# EAGLE design sensor (EAGLE 5.06)
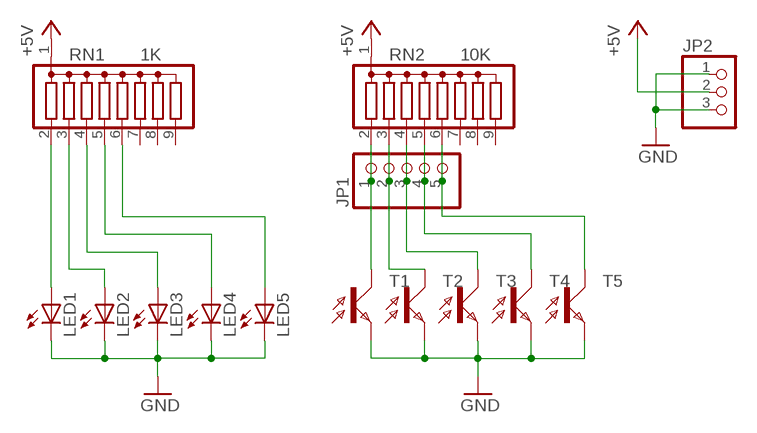
[diagram p0: schematic, sheet 1]

## Parts
JP1  PINHD-1X5  [1X05]
JP2  PINHD-1X3180  [1X03]
LED1  LED5MM  [LED5MM]
LED2  LED5MM  [LED5MM]
LED3  LED5MM  [LED5MM]
LED4  LED5MM  [LED5MM]
LED5  LED5MM  [LED5MM]
RN1  1K  G08R  [SIL9]
RN2  10K  G08R  [SIL9]
T1  BPX81  [LED5MM]
T2  BPX81  [LED5MM]
T3  BPX81  [LED5MM]
T4  BPX81  [LED5MM]
T5  BPX81  [LED5MM]

## Nets
+5V: JP2.2 RN1.1 RN2.1
GND: JP2.1 JP2.3 LED1.K(C) LED2.K(C) LED3.K(C) LED4.K(C) LED5.K(C) T1.A(E) T2.A(E) T3.A(E) T4.A(E) T5.A(E)
N$1: LED1.A RN1.2
N$2: LED2.A RN1.3
N$3: LED3.A RN1.4
N$4: LED4.A RN1.5
N$5: LED5.A RN1.6
N$6: JP1.1 RN2.2 T1.K(C)
N$7: JP1.2 RN2.3 T2.K(C)
N$8: JP1.3 RN2.4 T3.K(C)
N$9: JP1.4 RN2.5 T4.K(C)
N$10: JP1.5 RN2.6 T5.K(C)
Unconnected: RN1.7 RN1.8 RN1.9 RN2.7 RN2.8 RN2.9

## Library data of the parts
JP1 = carrinho:PINHD-1X5: PIN HEADER
JP2 = carrinho:PINHD-1X3: PIN HEADER
LED1-LED5 = carrinho:LED: LED OSRAM: - CHIPLED LG R971, LG N971, LY N971, LG Q971, LY Q971, LO R971, LY R971 LH N974, LH R974 LS Q976, LO Q976, LY Q976 LO Q996 - Hyper CHIPLED LW Q18S LB Q993, LB Q99A, LB R99A - SideLED LS A670, LO A670, LY A670, LG A670, LP A670 LB A673, LV A673, LT A673, LW A673 LH A674 LY A675 LS A676, LA A676, LO A676, LY A676, LW A676 LS A679, LY A679, LG A679 - Hyper Micro SIDELED® LS Y876, LA Y876, LO Y876, LY Y876 LT Y87S - SmartLED LW L88C, LW L88S LB L89C, LB L89S, LG L890 LS L89K, LO L89K, LY L89K LS L896, LA L896, LO L896, LY L896 - TOPLED LS T670, LO T670, LY T670, LG T670, LP T670 LSG T670, LSP T670, LSY T670, LOP T670, LYG T670 LG T671, LOG T671, LSG T671 LB T673, LV T673, LT T673, LW T673 LH T674 LS T676, LA T676, LO T676, LY T676, LB T676, LH T676, LSB T676, LW T676 LB T67C, LV T67C, LT T67C, LS T67K, LO T67K, LY T67K, LW E67C LS E67B, LA E67B, LO E67B, LY E67B, LB E67C, LV E67C, LT E67C LW T67C LS T679, LY T679, LG T679 LS T770, LO T770, LY T770, LG T770, LP T770 LB T773, LV T773, LT T773, LW T773 LH T774 LS E675, LA E675, LY E675, LS T675 LS T776, LA T776, LO T776, LY T776, LB T776 LHGB T686 LT T68C, LB T68C - Hyper Mini TOPLED® LB M676 - Mini TOPLED Santana® LG M470 LS M47K, LO M47K, LY M47K Source: http://www.osram.convergy.de - LUMILED® LXK2-PW12-R00, LXK2-PW12-S00, LXK2-PW14-U00, LXK2-PW14-V00 LXK2-PM12-R00, LXK2-PM12-S00, LXK2-PM14-U00 LXK2-PE12-Q00, LXK2-PE12-R00, LXK2-PE12-S00, LXK2-PE14-T00, LXK2-PE14-U00 LXK2-PB12-K00, LXK2-PB12-L00, LXK2-PB12-M00, LXK2-PB14-N00, LXK2-PB14-P00, LXK2-PB14-Q00 LXK2-PR12-L00, LXK2-PR12-M00, LXK2-PR14-Q00, LXK2-PR14-R00 LXK2-PD12-Q00, LXK2-PD12-R00, LXK2-PD12-S00 LXK2-PH12-R00, LXK2-PH12-S00 LXK2-PL12-P00, LXK2-PL12-Q00, LXK2-PL12-R00 Source: www.luxeon.com
RN1 RN2 = carrinho:G08R: SIL RESISTOR
T1-T5 = carrinho:BPX81: PHOTO TRANSISTOR

## Board
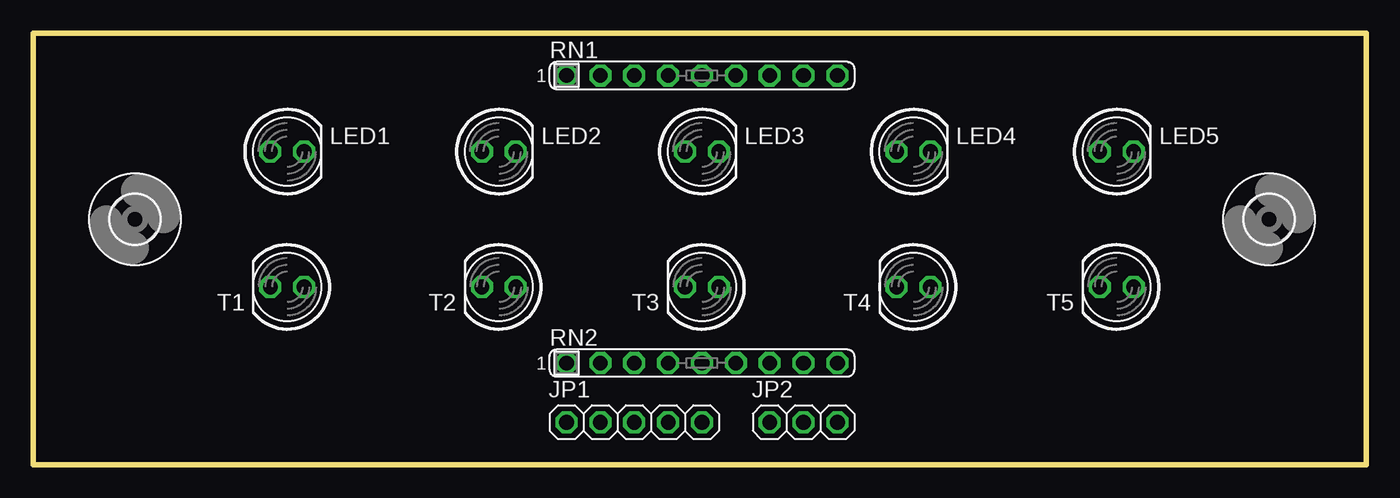
[diagram p1: board, top side]
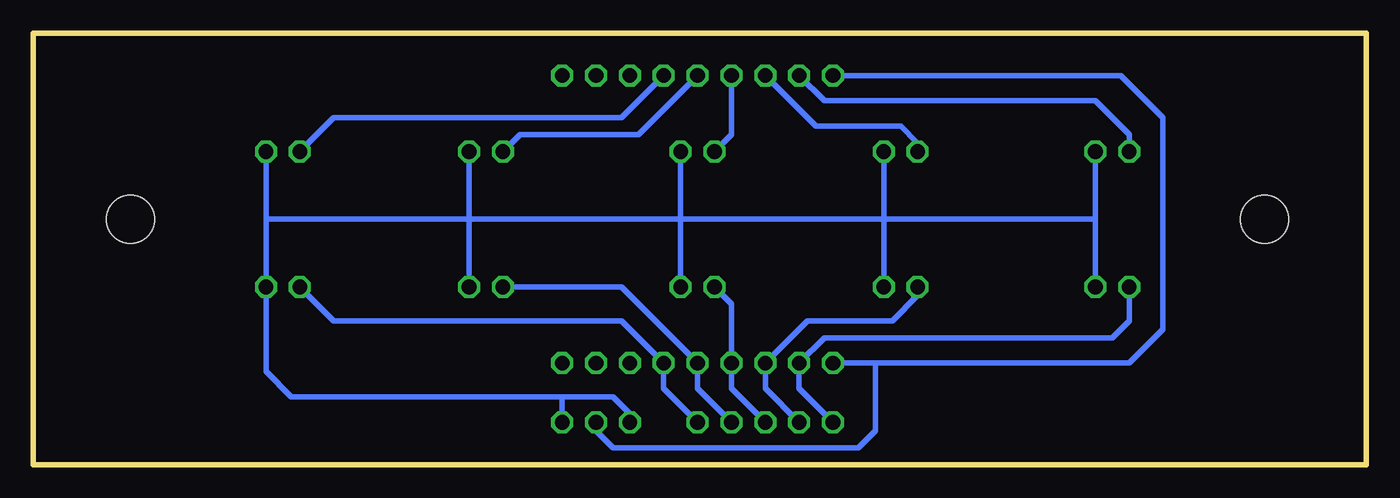
[diagram p2: board, bottom side, seen from below]

Size 100 x 32.38 mm. Coordinates in mm from the lower left corner, seen from the top.
Outline: 0,0 100,0 100,32.38 0,32.38 0,0
Copper layers (1*16): Top 0.035mm / dielectric 1.5mm / Bottom 0.035mm
Design rules "default": minimum track width 10mil, minimum drill 24mil, track to track 8mil, track to pad 8mil, pad to pad 8mil, via to via 8mil, smd to smd 8mil, copper to edge 40mil, drill to drill 8mil, minimum pad ring 10mil, minimum via ring 8mil, stop-mask expansion 4mil, vias tented up to drill 0mil, thermal gap 10mil

### Footprints (pad centres in the part's own frame; a part is rotated, then mirrored left to right if it is on the bottom)
1X05 = drill 1.1 octagon: 1 -5.08,0; 2 -2.54,0; 3 0,0; 4 2.54,0; 5 5.08,0
1X03 = drill 1.1 octagon: 1 -2.54,0; 2 0,0; 3 2.54,0
LED5MM = drill 1.1 octagon: A -1.27,0; K 1.27,0
SIL9 = drill 1.1 octagon: 1 -10.16,0; 2 -7.62,0; 3 -5.08,0; 4 -2.54,0; 5 0,0; 6 2.54,0; 7 5.08,0; 8 7.62,0; 9 10.16,0
3,6 = hole 3.6: 0,0

### Placement (x,y rotation side)
JP1  45.09,3.17 0 top
JP2  57.78,3.17 0 top
LED1  19.05,23.49 0 top
LED2  34.92,23.49 0 top
LED3  50.16,23.49 0 top
LED4  66.04,23.49 0 top
LED5  81.28,23.49 0 top
RN1  50.16,29.21 0 top
RN2  50.16,7.62 0 top
T1  19.05,13.34 180 top
T2  34.92,13.34 180 top
T3  50.16,13.34 180 top
T4  66.04,13.34 180 top
T5  81.28,13.34 180 top
U$1  [3,6]  7.62,18.41 0 top
U$2  [3,6]  92.71,18.41 0 top

### Tracks (layer width: path | path; a pad name or v marks a point on that pad's centre or on a via)
+5V
  Bottom 0.406: JP2.2 57.78,2.54 56.52,1.27 38.1,1.27 36.83,2.54 36.83,7.62 | RN1.1 18.41,29.21 15.24,26.04 15.24,10.16 17.78,7.62 36.83,7.62 | 36.83,7.62 RN2.1
GND
  Bottom 0.406: 60.33,5.08 JP2.3 | 60.33,5.08 80.64,5.08 82.55,6.99 T5.A 82.55,18.41 | T1.A 20.32,18.41 | 36.2,18.41 T2.A | 51.44,18.41 LED3.K | 67.31,18.41 T4.A | 67.31,18.41 LED4.K | 82.55,18.41 LED5.K | 20.32,18.41 LED1.K | 20.32,18.41 36.2,18.41 | 36.2,18.41 LED2.K | 36.2,18.41 51.44,18.41 | 51.44,18.41 T3.A | 51.44,18.41 67.31,18.41 | 67.31,18.41 82.55,18.41 | JP2.1 55.24,3.81 56.52,5.08 60.33,5.08
N$1
  Bottom 0.406: LED1.A 17.78,24.76 20.32,27.3 40.64,27.3 RN1.2
N$2
  Bottom 0.406: LED2.A 33.66,24.13 34.92,25.4 41.27,25.4 RN1.3
N$3
  Bottom 0.406: RN1.4 47.62,24.76 LED3.A
N$4
  Bottom 0.406: RN1.5 54.61,24.76 63.5,24.76 LED4.A
N$5
  Bottom 0.406: RN1.6 55.88,26.04 77.47,26.04 LED5.A
N$6
  Bottom 0.406: T1.K 17.78,10.79 19.05,9.53 40.64,9.53 RN2.2 42.55,5.71 JP1.1
N$7
  Bottom 0.406: T2.K 33.66,12.7 35.56,10.79 41.91,10.79 RN2.3 45.09,5.71 JP1.2
N$8
  Bottom 0.406: T3.K 47.62,12.06 RN2.4 47.62,5.71 JP1.3
N$9
  Bottom 0.406: T4.K 55.88,13.34 RN2.5 50.16,5.71 JP1.4
N$10
  Bottom 0.406: T5.K 77.47,10.79 55.88,10.79 RN2.6 52.7,5.71 JP1.5